# Altium schematic sheet LPCB235 - BRAKE FAILSAFE.SchDoc
size A3; Address1: Factory 10; Address2: 9-13 Dingley Avenue, Dandeong, VICTORIA 3175, AUSTRALIA; DocumentNumber: 7; Revision: 1; SheetNumber: 7; SheetTotal: 37; Lockie__PCB_SUB_ASSEMBLY: Brake Failsafe System; Lockie__PCB_ASSEMBLY: FCU PCB; Lockie__LDL: LPCB235; Lockie__PCB_DESCRIPTION: Flight Control Unit
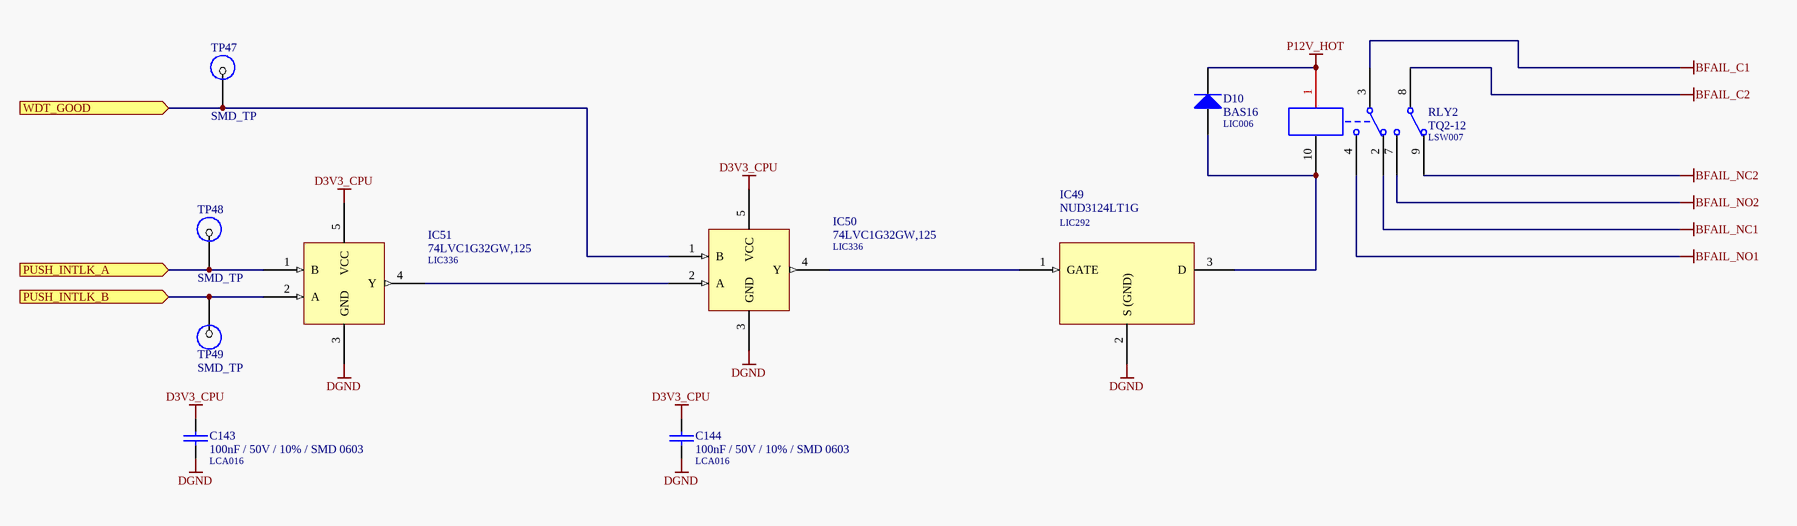
[diagram p0: LPCB235 - BRAKE FAILSAFE.SchDoc]

## Parts
C143  100nF / 50V / 10% / SMD 0603  LDL_NUMBER: LCA016  [LFP011__CC1608-0603-IPC7351_B]
C144  100nF / 50V / 10% / SMD 0603  LDL_NUMBER: LCA016  [LFP011__CC1608-0603-IPC7351_B]
D10  BAS16  LDL_NUMBER: LIC006  [LFP021__SOT23]
IC49  NUD3124LT1G  LDL_NUMBER: LIC292  [LFP021__SOT23]
IC50  74LVC1G32GW,125  LDL_NUMBER: LIC336  [LFP047__SOT353]
IC51  74LVC1G32GW,125  LDL_NUMBER: LIC336  [LFP047__SOT353]
RLY2  TQ2-12  LDL_NUMBER: LSW007  [TQ2]
TP47  SMD_TP  [SMD-TP]  (no BOM)
TP48  SMD_TP  [SMD-TP]  (no BOM)
TP49  SMD_TP  [SMD-TP]  (no BOM)

## Ports
PUSH_INTLK_A (in), PUSH_INTLK_B (in), WDT_GOOD (in)

## Nets
BFAIL_C1: RLY2.3
BFAIL_C2: RLY2.8
BFAIL_NC1: RLY2.2
BFAIL_NC2: RLY2.9
BFAIL_NO1: RLY2.4
BFAIL_NO2: RLY2.7
D3V3_CPU: C143.1 C144.1 IC50.5(VCC) IC51.5(VCC)
DGND: C143.2 C144.2 IC49.2(S_(GND)) IC50.3(GND) IC51.3(GND)
P12V_HOT: D10.3(K) RLY2.1
PUSH_INTLK_A: IC51.1(B) TP48.1 ; port PUSH_INTLK_A
PUSH_INTLK_B: IC51.2(A) TP49.1 ; port PUSH_INTLK_B
WDT_GOOD: IC50.1(B) TP47.1 ; port WDT_GOOD
NetD10_1: D10.1(A) IC49.3(D) RLY2.10
NetIC49_1: IC49.1(GATE) IC50.4(Y)
NetIC50_2: IC50.2(A) IC51.4(Y)

## Notes on the sheet
- PCB COMPONENT DESCRIPTION
- LDL NUMBER
- Assembly Details
- Size
- Drawing File Name
- Revision
- http://rloop.org
- Scale
- A3
- Sheet Details
- N.T.S
- Sheet:
- Of:

## Library data of the parts
C143 C144 = 100nF / 50V / 10% / SMD 0603: Capacitor, Ceramic Chip, 100nF (0.1uF), 50V, 5%, SMD 0603 [LCA016]; Value: 100n; FMEDA__OPERATING__VOLTAGE_MIN: 0; FMEDA__OPERATING__VOLTAGE_MAX: 3.3; FMEDA__OPERATING__TEMP_MIN: -20; FMEDA__OPERATING__TEMP_TYP: 27; FMEDA__OPERATING__TEMP_MAX: 50; FMEDA__CHANNEL: COM; FMEDA__FUNCTION_IN_SYSTEM: *; FMEDA__OPERATING__VOLTAGE_TYP: 3.3
D10 = BAS16: Diode, Small Signal, 0.2A, 85V, SMD SOT-23 [LIC006]; FMEDA__OPERATING__CURRENT_MIN: 0; FMEDA__OPERATING__TEMP_MIN: -20; FMEDA__OPERATING__TEMP_TYP: 27; FMEDA__OPERATING__TEMP_MAX: 50; FMEDA__CHANNEL: COM; FMEDA__OPERATING__CURRENT_MAX: 0; FMEDA__OPERATING__VOLTAGE_MIN: 0; FMEDA__OPERATING__VOLTAGE_MAX: 0; FMEDA__FUNCTION_IN_SYSTEM: *; FMEDA__OPERATING__CURRENT_TYP: 0; FMEDA__OPERATING__VOLTAGE_TYP: 0
IC49 = NUD3124LT1G: IC, Relay Driver, 28V Industrial, SMD SOT23 [LIC292]; FMEDA__OPERATING__TEMP_MIN: -20; FMEDA__OPERATING__TEMP_TYP: 27; FMEDA__OPERATING__TEMP_MAX: 50; FMEDA__OPERATING__VOLTAGE_MIN: 0; FMEDA__OPERATING__VOLTAGE_TYP: 13; FMEDA__OPERATING__VOLTAGE_MAX: 18; FMEDA__OPERATING__POWER_TYP: 0.1; FMEDA__OPERATING__POWER_MAX: 0.15; FMEDA__CHANNEL: COM; FMEDA__FUNCTION_IN_SYSTEM: *; FMEDA__OPERATING__POWER_MIN: 0
IC50 IC51 = 74LVC1G32GW,125: IC, Logic OR Gate, Single 2 Input, SMD SOT353 [LIC336]; FMEDA__OPERATING__TEMP_MAX: 50; FMEDA__OPERATING__TEMP_MIN: -20; FMEDA__OPERATING__TEMP_TYP: 27; FMEDA__OPERATING__VOLTAGE_MAX: 0; FMEDA__CHANNEL: COM; FMEDA__FUNCTION_IN_SYSTEM: *; FMEDA__OPERATING__VOLTAGE_MIN: 0; FMEDA__OPERATING__VOLTAGE_TYP: 0
RLY2 = TQ2-12: Relay, DPDT, Non Latching, 12VDC Coil, 2A Rating, PTH; FMEDA__CHANNEL: COM; FMEDA__OPERATING__TEMP_MAX: 50; FMEDA__OPERATING__TEMP_MIN: -20; FMEDA__OPERATING__TEMP_TYP: 27; Revision: July-2002: Re-released for DXP Platform.
TP47-TP49 = SMD_TP: SMD Test Point; FMEDA__CHANNEL: COM; FMEDA__OPERATING__CURRENT_MAX: 0; FMEDA__OPERATING__TEMP_MAX: 50; FMEDA__OPERATING__TEMP_MIN: -20; FMEDA__OPERATING__TEMP_TYP: 27; FMEDA__OPERATING__VOLTAGE_MAX: 16; FMEDA__OPERATING__VOLTAGE_TYP: 12; FMEDA__OPERATING__CURRENT_MIN: 0; FMEDA__OPERATING__CURRENT_TYP: 0; FMEDA__OPERATING__VOLTAGE_MIN: 0